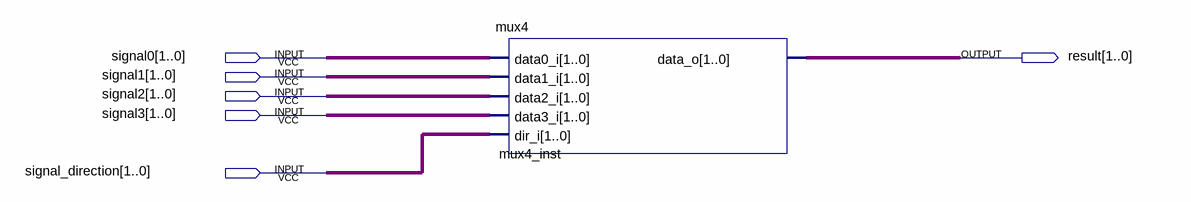
[diagram p0: schematic sheet]
// Quartus schematic top.bdf as structural Verilog: 1 symbols, 6 pins
module top (
  input  [1:0] signal0,
  input  [1:0] signal1,
  input  [1:0] signal2,
  input  [1:0] signal3,
  input  [1:0] signal_direction,
  output [1:0] result
);

  mux4 mux4_inst (
    .data0_i(signal0), .data1_i(signal1), .data2_i(signal2), .data3_i(signal3), .dir_i(signal_direction),
    .data_o(result));
endmodule
